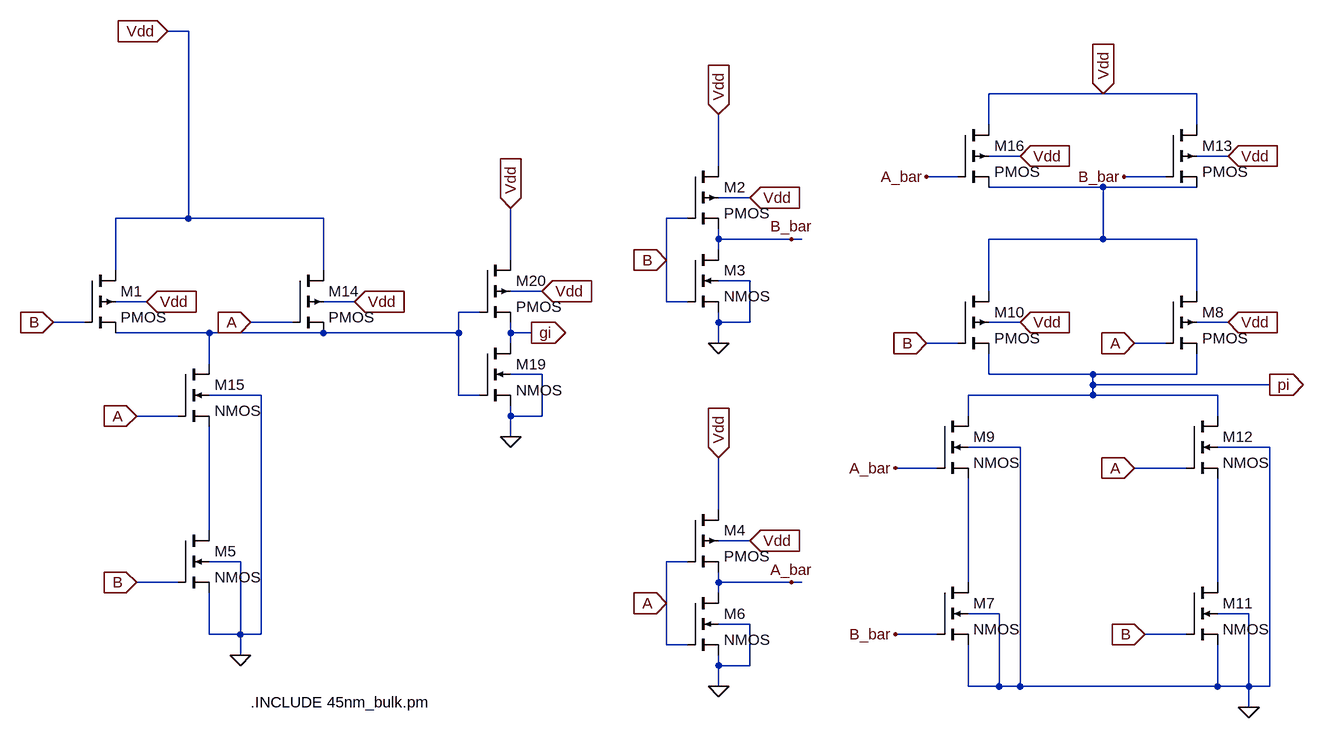
[diagram p0: schematic bit_prop_gen.asc]
bit_prop_gen.asc, the LTspice schematic file:
Version 4
SHEET 1 1744 680
WIRE -480 -848 -512 -848
WIRE 928 -752 752 -752
WIRE 1072 -752 928 -752
WIRE 752 -704 752 -752
WIRE 1072 -704 1072 -752
WIRE 800 -656 752 -656
WIRE 1120 -656 1072 -656
WIRE 336 -640 336 -720
WIRE 704 -624 656 -624
WIRE 1024 -624 960 -624
WIRE 928 -608 752 -608
WIRE 1072 -608 928 -608
WIRE 384 -592 336 -592
WIRE -480 -560 -480 -848
WIRE -480 -560 -592 -560
WIRE -272 -560 -480 -560
WIRE 288 -560 256 -560
WIRE 336 -528 336 -544
WIRE 448 -528 336 -528
WIRE 464 -528 448 -528
WIRE 928 -528 928 -608
WIRE 928 -528 752 -528
WIRE 1072 -528 928 -528
WIRE 336 -512 336 -528
WIRE 16 -496 16 -576
WIRE 256 -496 256 -560
WIRE -592 -480 -592 -560
WIRE -272 -480 -272 -560
WIRE 384 -464 336 -464
WIRE 64 -448 16 -448
WIRE 752 -448 752 -528
WIRE 1072 -448 1072 -528
WIRE -544 -432 -592 -432
WIRE -224 -432 -272 -432
WIRE 256 -432 256 -496
WIRE 288 -432 256 -432
WIRE -32 -416 -64 -416
WIRE -640 -400 -688 -400
WIRE -320 -400 -384 -400
WIRE 336 -400 336 -416
WIRE 384 -400 384 -464
WIRE 384 -400 336 -400
WIRE 800 -400 752 -400
WIRE 1120 -400 1072 -400
WIRE -448 -384 -592 -384
WIRE -272 -384 -448 -384
WIRE -64 -384 -64 -416
WIRE -64 -384 -272 -384
WIRE 16 -384 16 -400
WIRE 48 -384 16 -384
WIRE 16 -368 16 -384
WIRE 336 -368 336 -400
WIRE 704 -368 656 -368
WIRE 1024 -368 976 -368
WIRE -448 -336 -448 -384
WIRE 64 -320 16 -320
WIRE 752 -320 752 -352
WIRE 912 -320 752 -320
WIRE 1072 -320 1072 -352
WIRE 1072 -320 912 -320
WIRE 912 -304 912 -320
WIRE 1184 -304 912 -304
WIRE -368 -288 -448 -288
WIRE -64 -288 -64 -384
WIRE -32 -288 -64 -288
WIRE 912 -288 912 -304
WIRE 912 -288 720 -288
WIRE 1104 -288 912 -288
WIRE -496 -256 -560 -256
WIRE 16 -256 16 -272
WIRE 64 -256 64 -320
WIRE 64 -256 16 -256
WIRE 720 -256 720 -288
WIRE 1104 -256 1104 -288
WIRE 16 -224 16 -256
WIRE 800 -208 720 -208
WIRE 1184 -208 1104 -208
WIRE 672 -176 608 -176
WIRE 1056 -176 976 -176
WIRE 336 -112 336 -192
WIRE -448 -80 -448 -240
WIRE 384 -64 336 -64
WIRE -400 -32 -448 -32
WIRE 288 -32 256 -32
WIRE -496 0 -560 0
WIRE 336 0 336 -16
WIRE 448 0 336 0
WIRE 464 0 448 0
WIRE 720 0 720 -160
WIRE 1104 0 1104 -160
WIRE 336 16 336 0
WIRE 256 32 256 -32
WIRE 768 48 720 48
WIRE 1152 48 1104 48
WIRE 384 64 336 64
WIRE -448 80 -448 16
WIRE -400 80 -400 -32
WIRE -400 80 -448 80
WIRE -368 80 -368 -288
WIRE -368 80 -400 80
WIRE 672 80 608 80
WIRE 1056 80 992 80
WIRE 256 96 256 32
WIRE 288 96 256 96
WIRE -400 112 -400 80
WIRE 336 128 336 112
WIRE 384 128 384 64
WIRE 384 128 336 128
WIRE 336 160 336 128
WIRE 720 160 720 96
WIRE 768 160 768 48
WIRE 768 160 720 160
WIRE 800 160 800 -208
WIRE 800 160 768 160
WIRE 1104 160 1104 96
WIRE 1104 160 800 160
WIRE 1152 160 1152 48
WIRE 1152 160 1104 160
WIRE 1184 160 1184 -208
WIRE 1184 160 1152 160
WIRE 1152 192 1152 160
FLAG -560 0 B
IOPIN -560 0 In
FLAG -512 -848 Vdd
IOPIN -512 -848 In
FLAG 16 -576 Vdd
IOPIN 16 -576 In
FLAG -224 -432 Vdd
IOPIN -224 -432 In
FLAG 64 -448 Vdd
IOPIN 64 -448 In
FLAG 48 -384 gi
IOPIN 48 -384 Out
FLAG -688 -400 B
IOPIN -688 -400 In
FLAG -544 -432 Vdd
IOPIN -544 -432 In
FLAG -400 112 0
FLAG 16 -224 0
FLAG 336 -720 Vdd
IOPIN 336 -720 In
FLAG 384 -592 Vdd
IOPIN 384 -592 In
FLAG 336 -368 0
FLAG 336 -192 Vdd
IOPIN 336 -192 In
FLAG 384 -64 Vdd
IOPIN 384 -64 In
FLAG 336 160 0
FLAG 256 -496 B
IOPIN 256 -496 In
FLAG 256 32 A
IOPIN 256 32 In
FLAG 976 -368 A
IOPIN 976 -368 In
FLAG 1120 -400 Vdd
IOPIN 1120 -400 In
FLAG 656 -368 B
IOPIN 656 -368 In
FLAG 800 -400 Vdd
IOPIN 800 -400 In
FLAG 992 80 B
IOPIN 992 80 In
FLAG 976 -176 A
IOPIN 976 -176 In
FLAG 1152 192 0
FLAG 1120 -656 Vdd
IOPIN 1120 -656 In
FLAG 800 -656 Vdd
IOPIN 800 -656 In
FLAG 448 -528 B_bar
FLAG 960 -624 B_bar
FLAG 608 80 B_bar
FLAG 448 0 A_bar
FLAG 656 -624 A_bar
FLAG 608 -176 A_bar
FLAG 928 -752 Vdd
IOPIN 928 -752 In
FLAG 1184 -304 pi
IOPIN 1184 -304 Out
FLAG -384 -400 A
IOPIN -384 -400 In
FLAG -560 -256 A
IOPIN -560 -256 In
SYMBOL nmos4 -496 -80 R0
SYMATTR InstName M5
SYMATTR Value2 l=45n w=90n
SYMBOL pmos4 -320 -480 R0
SYMATTR InstName M14
SYMATTR Value2 l=45n w=90n
SYMBOL nmos4 -496 -336 R0
SYMATTR InstName M15
SYMATTR Value2 l=45n w=90n
SYMBOL pmos4 -32 -496 R0
SYMATTR InstName M20
SYMATTR Value2 l=45n w=90n
SYMBOL nmos4 -32 -368 R0
SYMATTR InstName M19
SYMATTR Value2 l=45n w=45n
SYMBOL pmos4 -640 -480 R0
SYMATTR InstName M1
SYMATTR Value2 l=45n w=90n
SYMBOL pmos4 288 -640 R0
SYMATTR InstName M2
SYMATTR Value2 l=45n w=90n
SYMBOL nmos4 288 -512 R0
SYMATTR InstName M3
SYMATTR Value2 l=45n w=45n
SYMBOL pmos4 288 -112 R0
SYMATTR InstName M4
SYMATTR Value2 l=45n w=90n
SYMBOL nmos4 288 16 R0
SYMATTR InstName M6
SYMATTR Value2 l=45n w=45n
SYMBOL nmos4 672 0 R0
SYMATTR InstName M7
SYMATTR Value2 l=45n w=90n
SYMBOL pmos4 1024 -448 R0
SYMATTR InstName M8
SYMATTR Value2 l=45n w=180n
SYMBOL nmos4 672 -256 R0
SYMATTR InstName M9
SYMATTR Value2 l=45n w=90n
SYMBOL pmos4 704 -448 R0
SYMATTR InstName M10
SYMATTR Value2 l=45n w=180n
SYMBOL nmos4 1056 0 R0
SYMATTR InstName M11
SYMATTR Value2 l=45n w=90n
SYMBOL nmos4 1056 -256 R0
SYMATTR InstName M12
SYMATTR Value2 l=45n w=90n
SYMBOL pmos4 1024 -704 R0
SYMATTR InstName M13
SYMATTR Value2 l=45n w=180n
SYMBOL pmos4 704 -704 R0
SYMATTR InstName M16
SYMATTR Value2 l=45n w=180n
TEXT -384 184 Left 2 !.INCLUDE 45nm_bulk.pm

The netlist it stands for:
* bit_prop_gen.asc
M5 N003 B 0 0 NMOS l=45n w=90n
M14 Vdd A N002 Vdd PMOS l=45n w=90n
M15 N002 A N003 0 NMOS l=45n w=90n
M20 Vdd N002 gi Vdd PMOS l=45n w=90n
M19 gi N002 0 0 NMOS l=45n w=45n
M1 Vdd B N002 Vdd PMOS l=45n w=90n
M2 Vdd B B_bar Vdd PMOS l=45n w=90n
M3 B_bar B 0 0 NMOS l=45n w=45n
M4 Vdd A A_bar Vdd PMOS l=45n w=90n
M6 A_bar A 0 0 NMOS l=45n w=45n
M7 N004 B_bar 0 0 NMOS l=45n w=90n
M8 N001 A pi Vdd PMOS l=45n w=180n
M9 pi A_bar N004 0 NMOS l=45n w=90n
M10 N001 B pi Vdd PMOS l=45n w=180n
M11 N005 B 0 0 NMOS l=45n w=90n
M12 pi A N005 0 NMOS l=45n w=90n
M13 Vdd B_bar N001 Vdd PMOS l=45n w=180n
M16 Vdd A_bar N001 Vdd PMOS l=45n w=180n
.model NMOS NMOS
.model PMOS PMOS
.lib standard.mos
.INCLUDE 45nm_bulk.pm
.backanno
.end